# Altium schematic sheet main.SchDoc
size A3; SheetNumber: 1; SheetTotal: 1
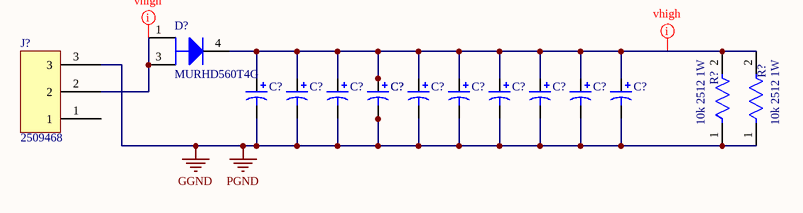
[diagram p0: main.SchDoc]

## Parts
(Parts that share a designator on the sheet are numbered #1, #2 ... from top to bottom, then left to right.)
C?#1  560uF 80V  [80ZLH560MEFC18X20]  (value not drawn)
C?#2  560uF 80V  [80ZLH560MEFC18X20]  (value not drawn)
C?#3  560uF 80V  [80ZLH560MEFC18X20]  (value not drawn)
C?#4  560uF 80V  [80ZLH560MEFC18X20]  (value not drawn)
C?#5  560uF 80V  [80ZLH560MEFC18X20]  (value not drawn)
C?#6  560uF 80V  [80ZLH560MEFC18X20]  (value not drawn)
C?#7  560uF 80V  [80ZLH560MEFC18X20]  (value not drawn)
C?#8  560uF 80V  [80ZLH560MEFC18X20]  (value not drawn)
C?#9  560uF 80V  [80ZLH560MEFC18X20]  (value not drawn)
C?#10  560uF 80V  [80ZLH560MEFC18X20]  (value not drawn)
C?#11  560uF 80V  [80ZLH560MEFC18X20]  (value not drawn)
D?  MURHD560T4G  [ONSC-DPAK-3-369C-01_V]
J?  Supplier Part Number 1: 2509468  [weidmuller_3p_20A]  (hidden comment: weidmuller_20A_3p)
R?#1  10k 2512 1W  [FP-CRCW2512-e3-IPC_C]
R?#2  10k 2512 1W  [FP-CRCW2512-e3-IPC_C]

## Nets
GGND: C?#1.2 C?#2.2 C?#3.2 C?#4.2 C?#5.2 C?#6.2 C?#7.2 C?#8.2 C?#9.2 C?#10.2 C?#11.2 J?.3 R?#1.1 R?#2.1  [also labelled PGND]
NetC?#1_1: C?#1.1 C?#2.1 C?#3.1 C?#4.1 C?#5.1 C?#6.1 C?#7.1 C?#8.1 C?#9.1 C?#10.1 C?#11.1 D?.4(K) R?#1.2 R?#2.2
NetD?_1: D?.1(A) D?.3(A) J?.2

Not connected (* = marked no-connect by the designer): J? 1

## Layout directives
net class vhigh: NetC?#1_1, NetD?_1

## Notes on the sheet
- 1
- 2
- 3
- 4
- 5
- 6
- 7
- 8
- A
- B
- C
- D
- Project:
- Date:
- Drawing number:
- Rev:
- Format:
- A3
- Drawn by:
- Laboratory:
- Page
- Sheet:
- of
- File:

## Library data of the parts
C?#1-C?#11 = Cap Pol1: Polarized Capacitor (Radial); Published: 8-Jun-2000; LatestRevisionDate: 17-Jul-2002; LatestRevisionNote: Re-released for DXP Platform.; PackageReference: RB7.6-15; Publisher: Altium Limited; PackageDescription: Polarized Capacitor (Radial); 2 Leads; Value: 560uF; Supplier 1: Digi-Key; Supplier Part Number 1: 1189-3057-ND
D? = CMP-0902-00243-1: Power Rectifier, 3-Pin DPAK, Pb-Free, Tape and Reel; Manufacturer: On Semiconductor; Type: Ultrafast; VRRM Max (V): 600; IFSM Max (A): 50; Mounting Technology: Surface Mount; RoHS: TRUE; PartNumber: MURHD560T4G; PackageVersion: Rev. E, 02/2014; ComponentLink3URL: http://www.onsemi.cn/pub_link/Collateral/369C.PDF; ComponentLink1Description: Manufacturer URL; PackageDescription: 3-Pin Flange Mount, Body 6.54 x 6.095 mm, Pitch 2.29 mm; ComponentLink3Description: Package Specification; ComponentLink1URL: http://www.onsemi.com/; Packing: Tape and Reel; ComponentLink2URL: http://www.onsemi.cn/pub_link/Collateral/MURHD560-D.PDF; ComponentLink2Description: Datasheet; PackageReference: DPAK-3-369C-01; DatasheetVersion: Rev. 8
J? = weidmuller_20A_3p: 3 Pin Terminal Block 19A Male Receptor; Supplier 1: Farnell
R?#1 R?#2 = CMP-02407-002758-1: RES Thick Film, 10kΩ, 5%, 1W, 200ppm/°C, 2512 / CRCW251210K0JNEG; Resistance: 10kR; Voltage Rating: 500V; Termination: SMD/SMT; Weight: 0.001429oz; Number of Terminations: 2; Package Quantity: 1; Case/Package: 2512; Length: 6.3mm; Temperature Coefficient: 200ppm/°C; Packaging: Tape and Reel; Voltage Rating (DC): 500V; Case Code (Imperial): 2512; Max Operating Temperature: 155°C; Number of Pins: 2; Height: 0.028inch; Military Standard: Not; Lead Free: Lead Free; Min Operating Temperature: -55°C; Features: Automotive AEC-Q200; Contact Plating: Tin; Depth: 3.15mm; Mount: Surface Mount; REACH SVHC: No SVHC; Composition: Thick Film; Radiation Hardening: No; Max Power Dissipation: 1W; Case Code (Metric): 6432; Power Rating: 1W; Width: 0.124inch; Tolerance: 5%